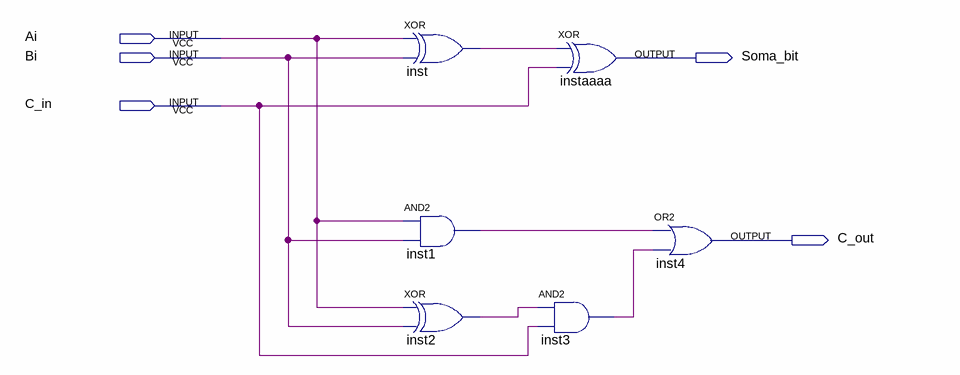
[diagram p0: schematic sheet]
// Quartus schematic somador_Ai_com_Bi_.bdf as structural Verilog: 6 symbols, 5 pins
module somador_Ai_com_Bi_ (
  input  Ai,
  input  Bi,
  input  C_in,
  output Soma_bit,
  output C_out
);

  wire inst1_out, inst2_out, inst3_out, inst_out;

  xor inst (inst_out, Ai, Bi);
  and inst1 (inst1_out, Ai, Bi);
  xor inst2 (inst2_out, Ai, Bi);
  xor instaaaa (Soma_bit, inst_out, C_in);
  and inst3 (inst3_out, inst2_out, C_in);
  or inst4 (C_out, inst1_out, inst3_out);
endmodule
